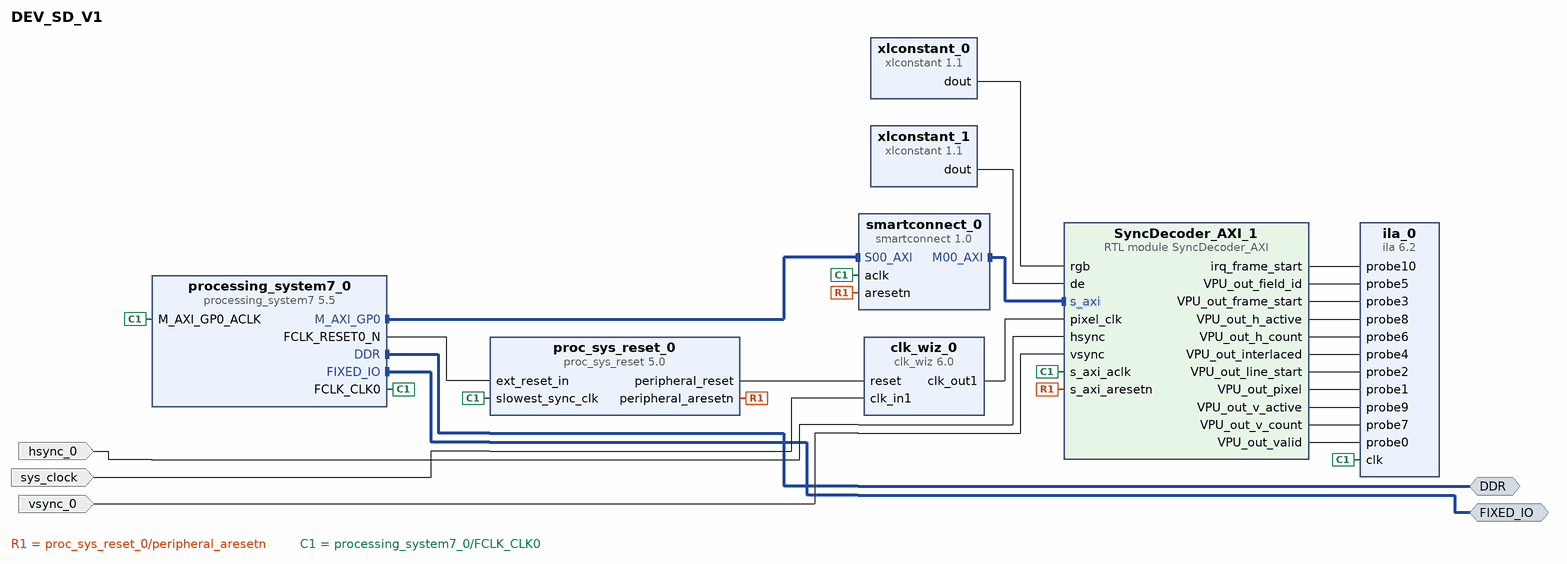
[diagram p0: block diagram of the top level]
# Vivado block design DEV_SD_V1, xc7z010clg400-1, Vivado 2025.2
create_bd_design DEV_SD_V1

create_bd_intf_port -mode Master -vlnv xilinx.com:interface:ddrx_rtl:1.0 DDR
create_bd_intf_port -mode Master -vlnv xilinx.com:display_processing_system7:fixedio_rtl:1.0 FIXED_IO
create_bd_port -dir I -type clk sys_clock
set_property -dict {CONFIG.FREQ_HZ 125000000 CONFIG.PHASE 0.0} [get_bd_ports sys_clock]
create_bd_port -dir I hsync_0
create_bd_port -dir I vsync_0

create_bd_cell -type ip -vlnv xilinx.com:ip:processing_system7:5.5 processing_system7_0
set_property -dict [list \
  CONFIG.PCW_APU_PERIPHERAL_FREQMHZ 666.666666 \
  CONFIG.PCW_ENET0_ENET0_IO {MIO 16 .. 27} \
  CONFIG.PCW_ENET0_GRP_MDIO_ENABLE 1 \
  CONFIG.PCW_ENET0_GRP_MDIO_IO {MIO 52 .. 53} \
  CONFIG.PCW_ENET0_PERIPHERAL_ENABLE 1 \
  CONFIG.PCW_ENET0_RESET_ENABLE 0 \
  CONFIG.PCW_ENET_RESET_ENABLE 1 \
  CONFIG.PCW_ENET_RESET_SELECT {Share reset pin} \
  CONFIG.PCW_GPIO_MIO_GPIO_ENABLE 1 \
  CONFIG.PCW_GPIO_MIO_GPIO_IO MIO \
  CONFIG.PCW_I2C_RESET_ENABLE 1 \
  CONFIG.PCW_PRESET_BANK1_VOLTAGE {LVCMOS 1.8V} \
  CONFIG.PCW_QSPI_GRP_FBCLK_ENABLE 1 \
  CONFIG.PCW_QSPI_GRP_FBCLK_IO {MIO 8} \
  CONFIG.PCW_QSPI_GRP_SINGLE_SS_ENABLE 1 \
  CONFIG.PCW_QSPI_GRP_SINGLE_SS_IO {MIO 1 .. 6} \
  CONFIG.PCW_QSPI_PERIPHERAL_ENABLE 1 \
  CONFIG.PCW_QSPI_QSPI_IO {MIO 1 .. 6} \
  CONFIG.PCW_SD0_GRP_CD_ENABLE 1 \
  CONFIG.PCW_SD0_GRP_CD_IO {MIO 47} \
  CONFIG.PCW_SD0_GRP_WP_ENABLE 0 \
  CONFIG.PCW_SD0_PERIPHERAL_ENABLE 1 \
  CONFIG.PCW_SD0_SD0_IO {MIO 40 .. 45} \
  CONFIG.PCW_SDIO_PERIPHERAL_FREQMHZ 50 \
  CONFIG.PCW_SINGLE_QSPI_DATA_MODE x4 \
  CONFIG.PCW_UART1_PERIPHERAL_ENABLE 1 \
  CONFIG.PCW_UART1_UART1_IO {MIO 48 .. 49} \
  CONFIG.PCW_UART_PERIPHERAL_FREQMHZ 100 \
  CONFIG.PCW_UIPARAM_DDR_FREQ_MHZ 533.333333 \
  CONFIG.PCW_UIPARAM_DDR_MEMORY_TYPE {DDR 3 (Low Voltage)} \
  CONFIG.PCW_UIPARAM_DDR_PARTNO {MT41K256M16 RE-125} \
  CONFIG.PCW_USB0_PERIPHERAL_ENABLE 1 \
  CONFIG.PCW_USB0_RESET_ENABLE 1 \
  CONFIG.PCW_USB0_RESET_IO {MIO 46} \
  CONFIG.PCW_USB0_USB0_IO {MIO 28 .. 39} \
  CONFIG.PCW_USB_RESET_ENABLE 1 \
  CONFIG.PCW_USB_RESET_SELECT {Share reset pin} \
] [get_bd_cells processing_system7_0]
# 296 more settings of processing_system7_0 are not shown: defaults, MIO pin electricals, DDR timing, and values the tool derives
create_bd_cell -type ip -vlnv xilinx.com:ip:proc_sys_reset:5.0 proc_sys_reset_0
create_bd_cell -type ip -vlnv xilinx.com:ip:clk_wiz:6.0 clk_wiz_0
set_property -dict [list \
  CONFIG.CLKOUT1_JITTER 281.423 \
  CONFIG.CLKOUT1_PHASE_ERROR 365.405 \
  CONFIG.CLKOUT1_REQUESTED_OUT_FREQ 25.175 \
  CONFIG.CLK_IN1_BOARD_INTERFACE sys_clock \
  CONFIG.MMCM_CLKFBOUT_MULT_F 61.500 \
  CONFIG.MMCM_CLKOUT0_DIVIDE_F 43.625 \
  CONFIG.MMCM_DIVCLK_DIVIDE 7 \
  CONFIG.USE_BOARD_FLOW true \
] [get_bd_cells clk_wiz_0]
create_bd_cell -type ip -vlnv xilinx.com:ip:smartconnect:1.0 smartconnect_0
create_bd_cell -type ip -vlnv xilinx.com:ip:xlconstant:1.1 xlconstant_0
set_property -dict {CONFIG.CONST_WIDTH 24} [get_bd_cells xlconstant_0]
create_bd_cell -type ip -vlnv xilinx.com:ip:ila:6.2 ila_0
set_property -dict [list \
  CONFIG.C_MONITOR_TYPE Native \
  CONFIG.C_NUM_OF_PROBES 11 \
  CONFIG.C_PROBE1_WIDTH 24 \
  CONFIG.C_PROBE6_WIDTH 12 \
  CONFIG.C_PROBE7_WIDTH 12 \
  CONFIG.C_PROBE8_WIDTH 12 \
  CONFIG.C_PROBE9_WIDTH 12 \
] [get_bd_cells ila_0]
create_bd_cell -type ip -vlnv xilinx.com:ip:xlconstant:1.1 xlconstant_1
set_property -dict {CONFIG.CONST_VAL 0 CONFIG.CONST_WIDTH 1} [get_bd_cells xlconstant_1]
create_bd_cell -type module -reference SyncDecoder_AXI SyncDecoder_AXI_1

# ---- connections ----

connect_bd_intf_net [get_bd_intf_ports DDR] [get_bd_intf_pins processing_system7_0/DDR]
connect_bd_intf_net [get_bd_intf_ports FIXED_IO] [get_bd_intf_pins processing_system7_0/FIXED_IO]
connect_bd_intf_net [get_bd_intf_pins processing_system7_0/M_AXI_GP0] [get_bd_intf_pins smartconnect_0/S00_AXI]
connect_bd_intf_net [get_bd_intf_pins smartconnect_0/M00_AXI] [get_bd_intf_pins SyncDecoder_AXI_1/s_axi]
connect_bd_net [get_bd_pins SyncDecoder_AXI_1/irq_frame_start] [get_bd_pins ila_0/probe10]
connect_bd_net [get_bd_pins SyncDecoder_AXI_1/VPU_out_field_id] [get_bd_pins ila_0/probe5]
connect_bd_net [get_bd_pins SyncDecoder_AXI_1/VPU_out_frame_start] [get_bd_pins ila_0/probe3]
connect_bd_net [get_bd_pins SyncDecoder_AXI_1/VPU_out_h_active] [get_bd_pins ila_0/probe8]
connect_bd_net [get_bd_pins SyncDecoder_AXI_1/VPU_out_h_count] [get_bd_pins ila_0/probe6]
connect_bd_net [get_bd_pins SyncDecoder_AXI_1/VPU_out_interlaced] [get_bd_pins ila_0/probe4]
connect_bd_net [get_bd_pins SyncDecoder_AXI_1/VPU_out_line_start] [get_bd_pins ila_0/probe2]
connect_bd_net [get_bd_pins SyncDecoder_AXI_1/VPU_out_pixel] [get_bd_pins ila_0/probe1]
connect_bd_net [get_bd_pins SyncDecoder_AXI_1/VPU_out_v_active] [get_bd_pins ila_0/probe9]
connect_bd_net [get_bd_pins SyncDecoder_AXI_1/VPU_out_v_count] [get_bd_pins ila_0/probe7]
connect_bd_net [get_bd_pins SyncDecoder_AXI_1/VPU_out_valid] [get_bd_pins ila_0/probe0]
connect_bd_net [get_bd_pins clk_wiz_0/clk_out1] [get_bd_pins SyncDecoder_AXI_1/pixel_clk]
connect_bd_net -net hsync_0_1 [get_bd_ports hsync_0] [get_bd_pins SyncDecoder_AXI_1/hsync]
connect_bd_net [get_bd_pins proc_sys_reset_0/peripheral_aresetn] [get_bd_pins smartconnect_0/aresetn] [get_bd_pins SyncDecoder_AXI_1/s_axi_aresetn]
connect_bd_net [get_bd_pins proc_sys_reset_0/peripheral_reset] [get_bd_pins clk_wiz_0/reset]
connect_bd_net [get_bd_pins processing_system7_0/FCLK_CLK0] \
  [get_bd_pins proc_sys_reset_0/slowest_sync_clk] [get_bd_pins processing_system7_0/M_AXI_GP0_ACLK] \
  [get_bd_pins smartconnect_0/aclk] [get_bd_pins ila_0/clk] [get_bd_pins SyncDecoder_AXI_1/s_axi_aclk]
connect_bd_net [get_bd_pins processing_system7_0/FCLK_RESET0_N] [get_bd_pins proc_sys_reset_0/ext_reset_in]
connect_bd_net [get_bd_ports sys_clock] [get_bd_pins clk_wiz_0/clk_in1]
connect_bd_net -net vsync_0_1 [get_bd_ports vsync_0] [get_bd_pins SyncDecoder_AXI_1/vsync]
connect_bd_net [get_bd_pins xlconstant_0/dout] [get_bd_pins SyncDecoder_AXI_1/rgb]
connect_bd_net [get_bd_pins xlconstant_1/dout] [get_bd_pins SyncDecoder_AXI_1/de]

# ---- address map ----
assign_bd_address -offset 0x40000000 -range 4K -target_address_space [get_bd_addr_spaces processing_system7_0/Data] [get_bd_addr_segs SyncDecoder_AXI_1/s_axi/reg0]

validate_bd_design
save_bd_design
